# EAGLE design raspilot (EAGLE 7.2.0)
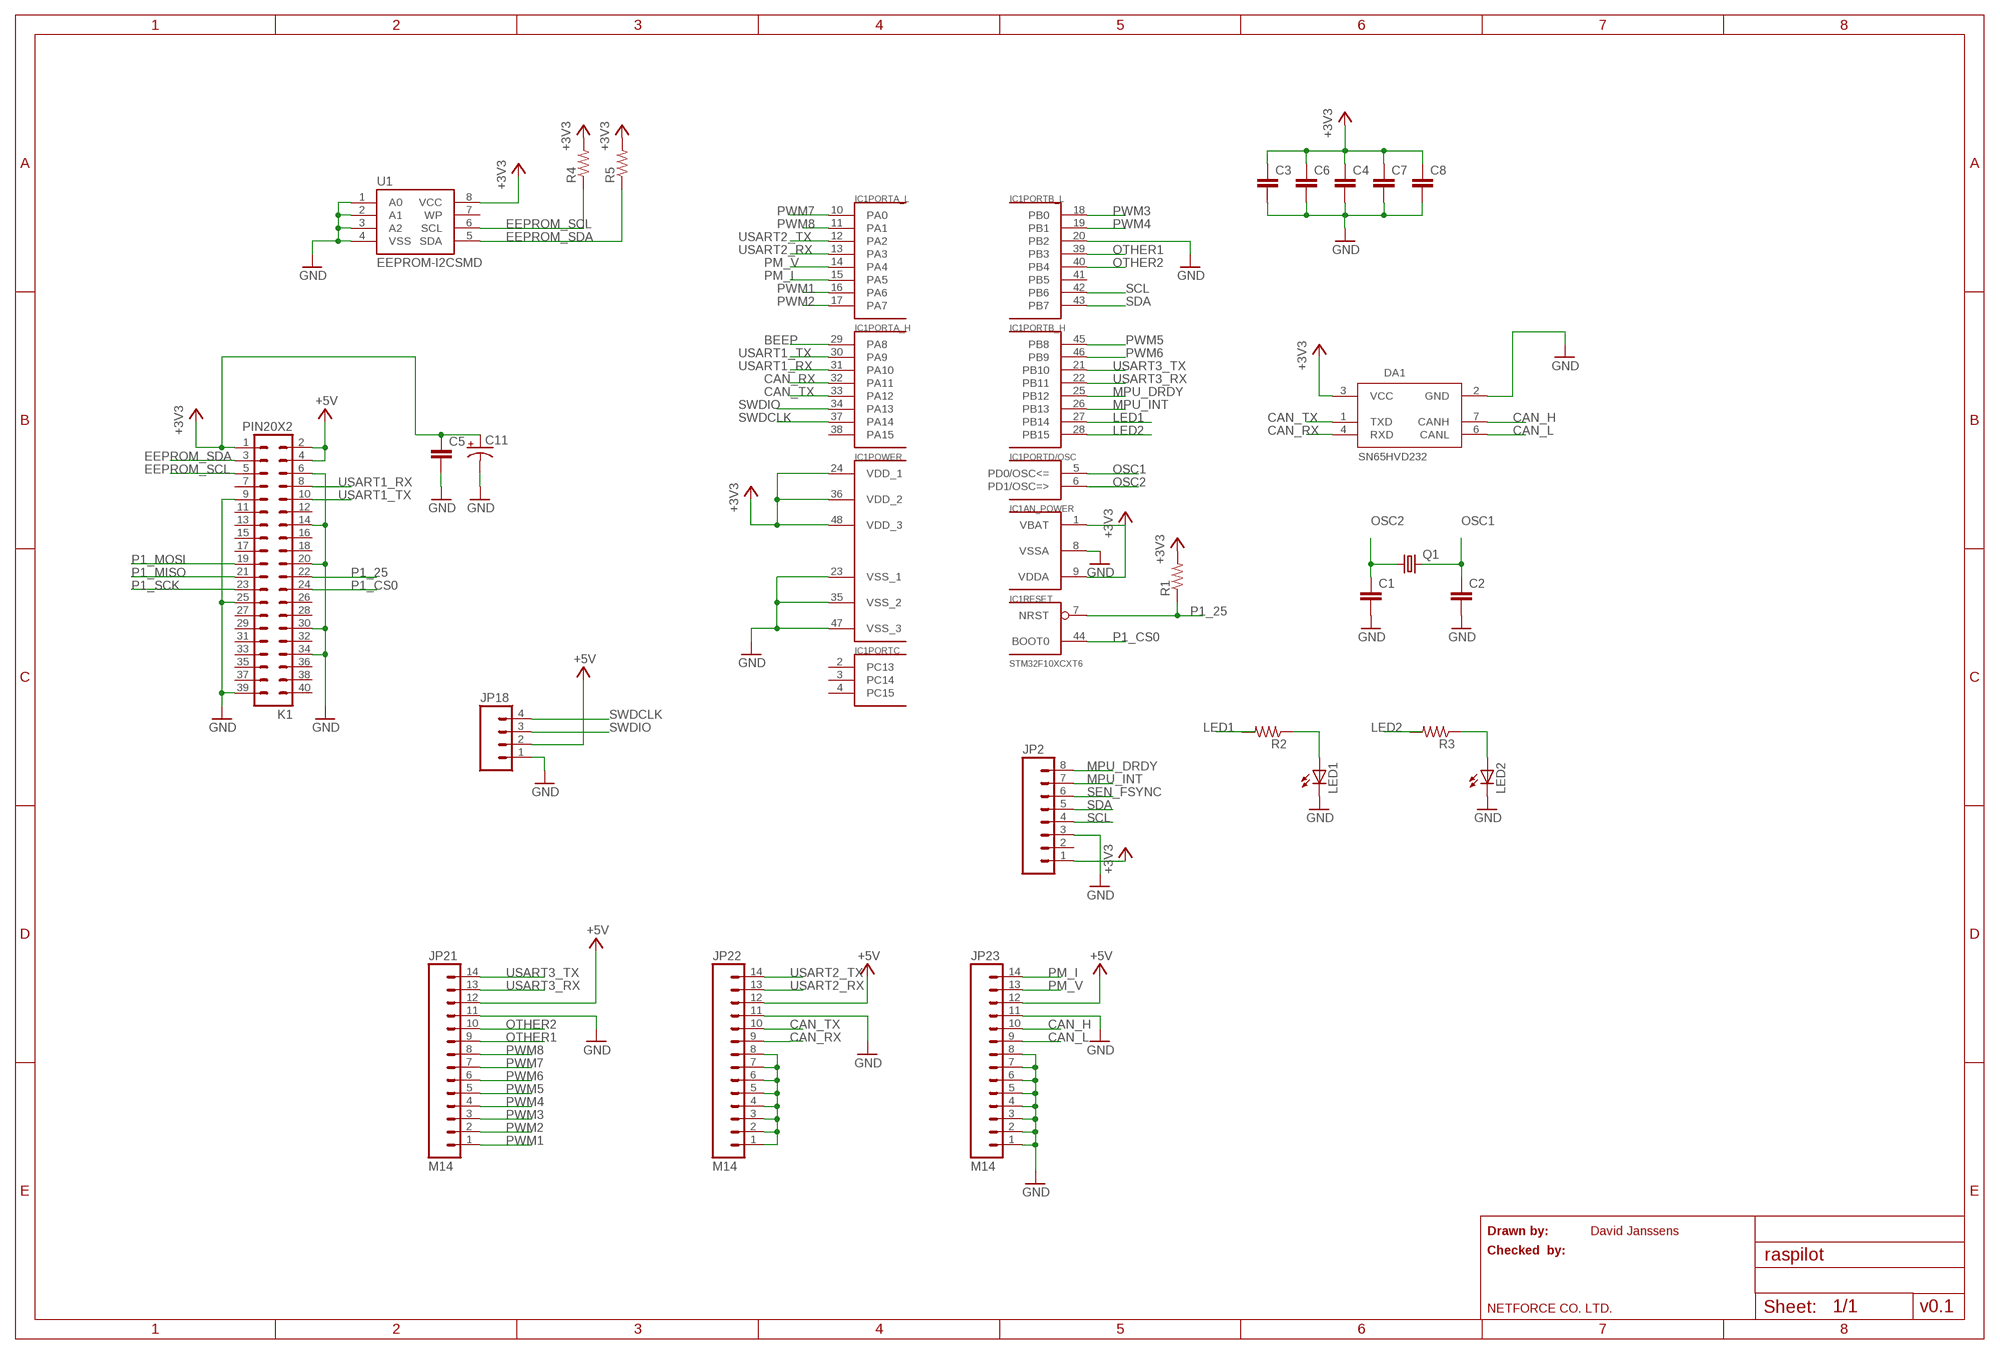
[diagram p0: schematic, sheet 1]

## Parts
C1  CAP0805  [0805]
C2  CAP0805  [0805]
C3  CAP0805  [0805]
C4  CAP0805  [0805]
C5  CAP0805  [0805]
C6  CAP0805  [0805]
C7  CAP0805  [0805]
C8  CAP0805  [0805]
C11  CPOL-USE2.5-6  [E2,5-6]
DA1  SN65HVD232  [SO08]
IC1  STM32F10XCXT6  [TQFP48]
JP2  M08  [1X08_ROUND]
JP18  M04PTH  [1X04]
JP21  M14  [1X14]
JP22  M14  [1X14]
JP23  M14  [1X14]
K1  PIN20X2  [PIN_20X2]
LED1  LED3MM  [LED3MM]
LED2  LED3MM  [LED3MM]
Q1  CRYSTALHC49S  [HC49/S]
R1  RESISTOR0805-RES  [0805]
R2  RESISTOR0805-RES  [0805]
R3  RESISTOR0805-RES  [0805]
R4  RESISTOR0805-RES  [0805]
R5  RESISTOR0805-RES  [0805]
U1  EEPROM-I2CSMD  [SO08]

## Nets
+3V3: C3.1 C4.1 C5.1 C6.1 C7.1 C8.1 C11.+ DA1.3(VCC) IC1.1(AN_POWER:VBAT) IC1.9(AN_POWER:VDDA) IC1.24(POWER:VDD_1) IC1.36(POWER:VDD_2) IC1.48(POWER:VDD_3) JP2.1 K1.1 R1.2 R4.2 R5.2 U1.8(VCC)
+5V: JP18.2 JP21.12 JP22.12 JP23.12 K1.2 K1.4
BEEP: IC1.29(PORTA_H:PA8)
CAN_H: DA1.7(CANH) JP23.10
CAN_L: DA1.6(CANL) JP23.9
CAN_RX: DA1.4(RXD) IC1.32(PORTA_H:PA11) JP22.9
CAN_TX: DA1.1(TXD) IC1.33(PORTA_H:PA12) JP22.10
EEPROM_SCL: K1.5 R4.1 U1.6(SCL)
EEPROM_SDA: K1.3 R5.1 U1.5(SDA)
GND: C1.2 C2.2 C3.2 C4.2 C5.2 C6.2 C7.2 C8.2 C11.- DA1.2(GND) IC1.8(AN_POWER:VSSA) IC1.20(PORTB_L:PB2) IC1.23(POWER:VSS_1) IC1.35(POWER:VSS_2) IC1.47(POWER:VSS_3) JP2.3 JP18.1 JP21.11 JP22.11 JP23.1 JP23.2 JP23.3 JP23.4 JP23.5 JP23.6 JP23.7 JP23.8 JP23.11 K1.6 K1.9 K1.14 K1.20 K1.25 K1.30 K1.34 K1.39 LED1.K(C) LED2.K(C) U1.1(A0) U1.2(A1) U1.3(A2) U1.4(VSS)
LED1: IC1.27(PORTB_H:PB14) R2.2
LED2: IC1.28(PORTB_H:PB15) R3.2
MPU_DRDY: IC1.25(PORTB_H:PB12) JP2.8
MPU_INT: IC1.26(PORTB_H:PB13) JP2.7
N$1: LED1.A R2.1
N$3: JP22.1 JP22.2 JP22.3 JP22.4 JP22.5 JP22.6 JP22.7 JP22.8
N$5: LED2.A R3.1
OSC1: C2.1 IC1.5(PORTD/OSC:PD0/OSC<=) Q1.2
OSC2: C1.1 IC1.6(PORTD/OSC:PD1/OSC=>) Q1.1
OTHER1: IC1.39(PORTB_L:PB3) JP21.9
OTHER2: IC1.40(PORTB_L:PB4) JP21.10
P1_25: IC1.7(RESET:NRST) K1.22 R1.1
P1_CS0: IC1.44(RESET:BOOT0) K1.24
P1_MISO: K1.21
P1_MOSI: K1.19
P1_SCK: K1.23
PM_I: IC1.15(PORTA_L:PA5) JP23.14
PM_V: IC1.14(PORTA_L:PA4) JP23.13
PWM1: IC1.16(PORTA_L:PA6) JP21.1
PWM2: IC1.17(PORTA_L:PA7) JP21.2
PWM3: IC1.18(PORTB_L:PB0) JP21.3
PWM4: IC1.19(PORTB_L:PB1) JP21.4
PWM5: IC1.45(PORTB_H:PB8) JP21.5
PWM6: IC1.46(PORTB_H:PB9) JP21.6
PWM7: IC1.10(PORTA_L:PA0) JP21.7
PWM8: IC1.11(PORTA_L:PA1) JP21.8
SCL: IC1.42(PORTB_L:PB6) JP2.4
SDA: IC1.43(PORTB_L:PB7) JP2.5
SEN_FSYNC: JP2.6
SWDCLK: IC1.37(PORTA_H:PA14) JP18.4
SWDIO: IC1.34(PORTA_H:PA13) JP18.3
USART1_RX: IC1.31(PORTA_H:PA10) K1.8
USART1_TX: IC1.30(PORTA_H:PA9) K1.10
USART2_RX: IC1.13(PORTA_L:PA3) JP22.13
USART2_TX: IC1.12(PORTA_L:PA2) JP22.14
USART3_RX: IC1.22(PORTB_H:PB11) JP21.13
USART3_TX: IC1.21(PORTB_H:PB10) JP21.14
Unconnected: IC1.2(PORTC:PC13) IC1.3(PORTC:PC14) IC1.4(PORTC:PC15) IC1.38(PORTA_H:PA15) IC1.41(PORTB_L:PB5) JP2.2 K1.7 K1.11 K1.12 K1.13 K1.15 K1.16 K1.17 K1.18 K1.26 K1.27 K1.28 K1.29 K1.31 K1.32 K1.33 K1.35 K1.36 K1.37 K1.38 K1.40 U1.7(WP)

## Notes on the sheet
- Drawn by: | David Janssens
- Checked  by:
- NETFORCE CO. LTD. | v0.1

## Library data of the parts
C1-C8 = SparkFun-Passives:CAP: Capacitor Standard 0603 ceramic capacitor, and 0.1" leaded capacitor.
C11 = adafruit:CPOL-US: POLARIZED CAPACITOR, American symbol
DA1 = transceiver:SN65HVD232: CAN TRANSCEIVER
IC1 = stm32:STM32F10XCXT6: ST STM32F101/103 48pin LQFP
JP2 = SparkFun-Connectors:M08: Header 8 Standard 8-pin 0.1" header. Use with straight break away headers (SKU : PRT-00116), right angle break away headers (PRT-00553), swiss pins (PRT-00743), machine pins (PRT-00117), and female headers (PRT-00115).
JP18 = SparkFun-Connectors:M04: Header 4 Standard 4-pin 0.1" header. Use with straight break away headers (SKU : PRT-00116), right angle break away headers (PRT-00553), swiss pins (PRT-00743), machine pins (PRT-00117), and female headers (PRT-00115). Molex polarized connector foot print use with SKU : PRT-08231 with associated crimp pins and housings. 1MM SMD Version SKU: PRT-10208
JP21-JP23 = SparkFun-Connectors:M14: Header 14 Standard 14-pin 0.1" header. Use with straight break away headers (SKU : PRT-00116), right angle break away headers (PRT-00553), swiss pins (PRT-00743), machine pins (PRT-00117), and female headers (PRT-00115).
K1 = FLYFISH:PIN20X2
LED1 LED2 = adafruit:LED: LED OSRAM: - CHIPLED LG R971, LG N971, LY N971, LG Q971, LY Q971, LO R971, LY R971 LH N974, LH R974 LS Q976, LO Q976, LY Q976 LO Q996 - Hyper CHIPLED LW Q18S LB Q993, LB Q99A, LB R99A - SideLED LS A670, LO A670, LY A670, LG A670, LP A670 LB A673, LV A673, LT A673, LW A673 LH A674 LY A675 LS A676, LA A676, LO A676, LY A676, LW A676 LS A679, LY A679, LG A679 - Hyper Micro SIDELED® LS Y876, LA Y876, LO Y876, LY Y876 LT Y87S - SmartLED LW L88C, LW L88S LB L89C, LB L89S, LG L890 LS L89K, LO L89K, LY L89K LS L896, LA L896, LO L896, LY L896 - TOPLED LS T670, LO T670, LY T670, LG T670, LP T670 LSG T670, LSP T670, LSY T670, LOP T670, LYG T670 LG T671, LOG T671, LSG T671 LB T673, LV T673, LT T673, LW T673 LH T674 LS T676, LA T676, LO T676, LY T676, LB T676, LH T676, LSB T676, LW T676 LB T67C, LV T67C, LT T67C, LS T67K, LO T67K, LY T67K, LW E67C LS E67B, LA E67B, LO E67B, LY E67B, LB E67C, LV E67C, LT E67C LW T67C LS T679, LY T679, LG T679 LS T770, LO T770, LY T770, LG T770, LP T770 LB T773, LV T773, LT T773, LW T773 LH T774 LS E675, LA E675, LY E675, LS T675 LS T776, LA T776, LO T776, LY T776, LB T776 LHGB T686 LT T68C, LB T68C - Hyper Mini TOPLED® LB M676 - Mini TOPLED Santana® LG M470 LS M47K, LO M47K, LY M47K Source: http://www.osram.convergy.de/
Q1 = adafruit:CRYSTAL: CRYSTAL; OC_FARNELL: 1667008; OC_NEWARK: unknown
R1-R5 = SparkFun-Passives:RESISTOR: Resistor Basic schematic elements and footprints for 0603, 1206, and PTH resistors.
U1 = SparkFun-DigitalIC:EEPROM-I2C: I2C EEPROM chips, 24LC256 (and others)

## Board
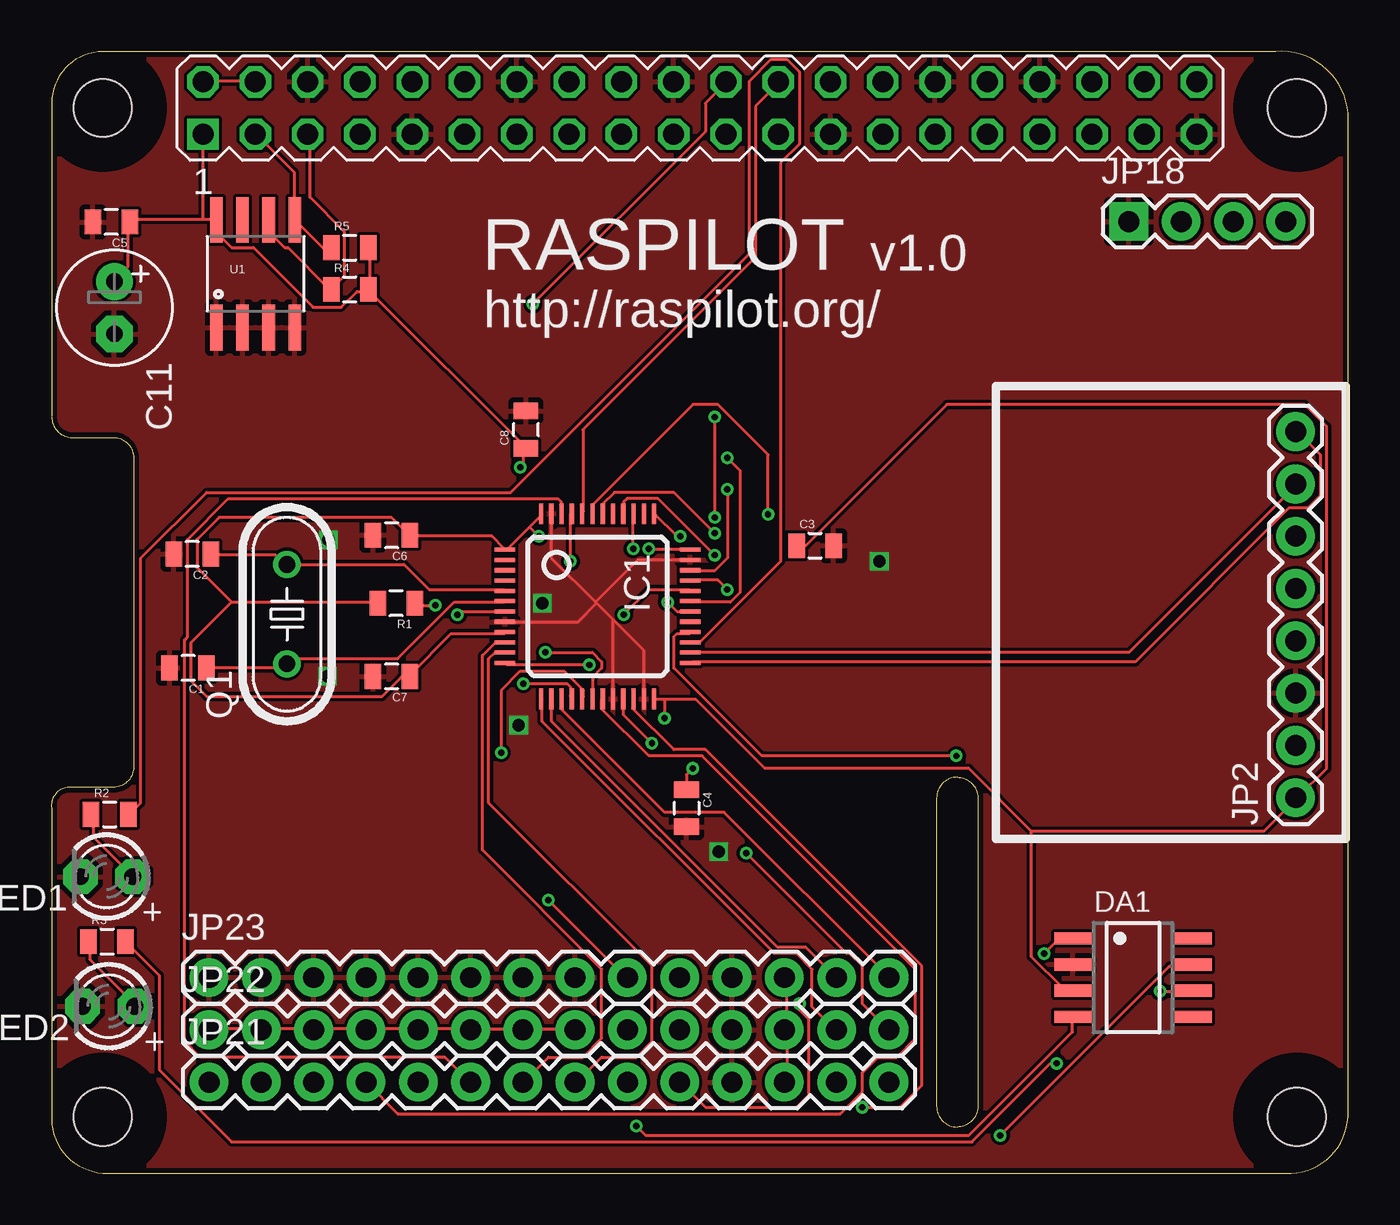
[diagram p1: board, top side]
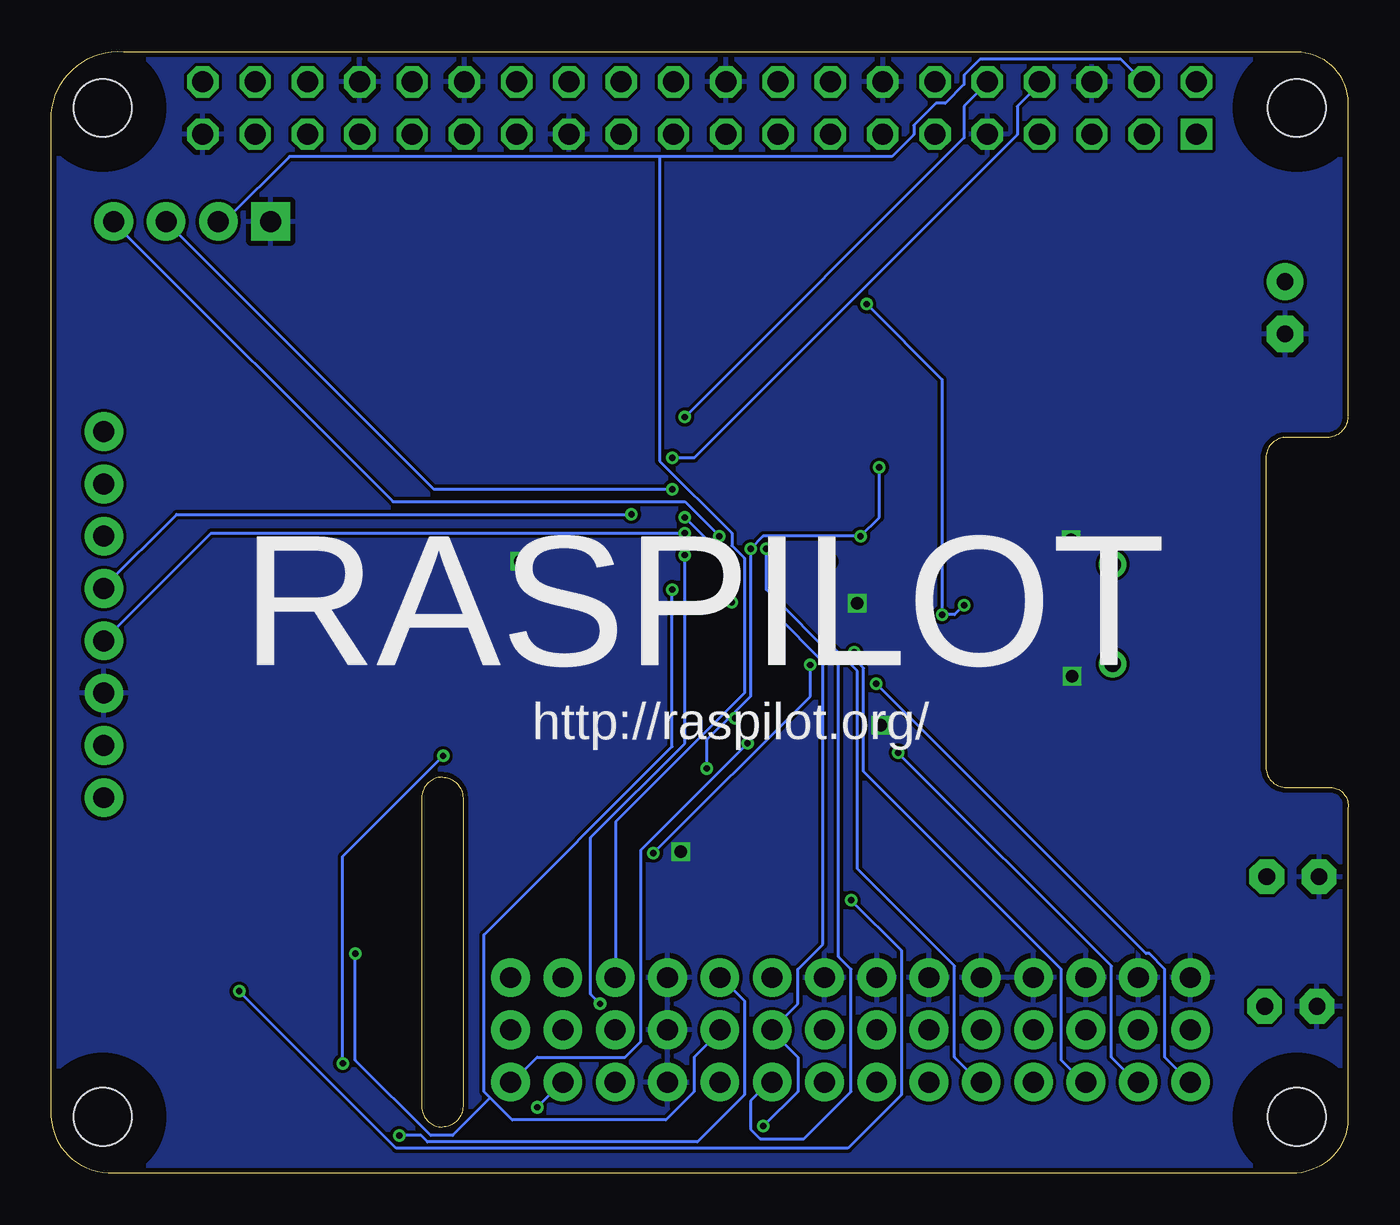
[diagram p2: board, bottom side, seen from below]

Size 62.98 x 54.49 mm. Coordinates in mm from the lower left corner, seen from the top.
Outline: 0.01,51.98 arc-90 2.5,54.48 59.47,54.48 arc-90 62.98,51.48 62.98,3 arc-90 60.23,0 2.5,0 arc-90 0.01,2.87 0.01,17.74 arc-90 0.75,18.74 2.99,18.74 arc90 3.99,19.74 3.99,34.74 arc90 2.99,35.74 1.01,35.74 arc-90 0.01,36.74
Outline: 0.01,52.03 0.01,36.78
Outline: 42.99,18.24 42.99,3.24 arc90 43.99,2.24 arc90 44.99,3.24 44.99,18.24 arc90 43.99,19.24 arc90 42.99,18.24
Copper layers (1*16): Top 0.035mm / dielectric 1.5mm / Bottom 0.035mm
Design rules "ITEADstudio_DRC": minimum track width 6mil, minimum drill 12mil, track to track 6mil, track to pad 6mil, pad to pad 6mil, via to via 6mil, smd to smd 0mil, copper to edge 10mil, drill to drill 10mil, minimum pad ring 10mil, minimum via ring 6mil, stop-mask expansion 2mil, vias tented up to drill 100mil, thermal gap 10mil
Holes 2.8 mm at 2.49,2.74 2.49,51.74 60.49,51.74 60.49,2.74
tRestrict: area 0.9,50.2 to 4,53.3; area 58.9,50.2 to 62,53.3; area 58.9,1.2 to 62,4.3; area 0.9,1.2 to 4,4.3
bRestrict: area 0.9,1.2 to 4,4.3; area 0.9,50.2 to 4,53.3; area 58.9,1.2 to 62,4.3; area 58.9,50.2 to 62,53.3
Milling: 6 lines

### Footprints (pad centres in the part's own frame; a part is rotated, then mirrored left to right if it is on the bottom)
0805 = smd 0.8 x 1.2: 1 -0.9,0; 2 0.9,0
E2,5-6 = drill 0.813 pad 1.778: + -1.27,0 | drill 0.813 pad 1.778 octagon: - 1.27,0
SO08 = smd 0.6 x 1.8: 1 -1.905,-2.917; 2 -0.635,-2.917; 3 0.635,-2.917; 4 1.905,-2.917; 5 1.905,2.917; 6 0.635,2.917; 7 -0.635,2.917; 8 -1.905,2.917
TQFP48 = smd 0.2 x 1: 1 -2.75,-4.5; 2 -2.25,-4.5; 3 -1.75,-4.5; 4 -1.25,-4.5; 5 -0.75,-4.5; 6 -0.25,-4.5; 7 0.25,-4.5; 8 0.75,-4.5; 9 1.25,-4.5; 10 1.75,-4.5; 11 2.25,-4.5; 12 2.75,-4.5; 25 2.75,4.5; 26 2.25,4.5; 27 1.75,4.5; 28 1.25,4.5; 29 0.75,4.5; 30 0.25,4.5; 31 -0.25,4.5; 32 -0.75,4.5; 33 -1.25,4.5; 34 -1.75,4.5; 35 -2.25,4.5; 36 -2.75,4.5 | smd 1 x 0.2: 13 4.5,-2.75; 14 4.5,-2.25; 15 4.5,-1.75; 16 4.5,-1.25; 17 4.5,-0.75; 18 4.5,-0.25; 19 4.5,0.25; 20 4.5,0.75; 21 4.5,1.25; 22 4.5,1.75; 23 4.5,2.25; 24 4.5,2.75; 37 -4.5,2.75; 38 -4.5,2.25; 39 -4.5,1.75; 40 -4.5,1.25; 41 -4.5,0.75; 42 -4.5,0.25; 43 -4.5,-0.25; 44 -4.5,-0.75; 45 -4.5,-1.25; 46 -4.5,-1.75; 47 -4.5,-2.25; 48 -4.5,-2.75
1X08_ROUND = drill 1.016 pad 1.88: 1 0,0; 2 2.54,0; 3 5.08,0; 4 7.62,0; 5 10.16,0; 6 12.7,0; 7 15.24,0; 8 17.78,0
1X04 = drill 1.016 pad 1.88 square: 1 0,0 | drill 1.016 pad 1.88: 2 2.54,0; 3 5.08,0; 4 7.62,0
1X14 = drill 1.016 pad 1.88: 1 0,0; 2 2.54,0; 3 5.08,0; 4 7.62,0; 5 10.16,0; 6 12.7,0; 7 15.24,0; 8 17.78,0; 9 20.32,0; 10 22.86,0; 11 25.4,0; 12 27.94,0; 13 30.48,0; 14 33.02,0
PIN_20X2 = drill 1.016 square: 1 -24.13,-1.27 | drill 1.016 octagon: 2 -24.13,1.27; 3 -21.59,-1.27; 4 -21.59,1.27; 5 -19.05,-1.27; 6 -19.05,1.27; 7 -16.51,-1.27; 8 -16.51,1.27; 9 -13.97,-1.27; 10 -13.97,1.27; 11 -11.43,-1.27; 12 -11.43,1.27; 13 -8.89,-1.27; 14 -8.89,1.27; 15 -6.35,-1.27; 16 -6.35,1.27; 17 -3.81,-1.27; 18 -3.81,1.27; 19 -1.27,-1.27; 20 -1.27,1.27; 21 1.27,-1.27; 22 1.27,1.27; 23 3.81,-1.27; 24 3.81,1.27; 25 6.35,-1.27; 26 6.35,1.27; 27 8.89,-1.27; 28 8.89,1.27; 29 11.43,-1.27; 30 11.43,1.27; 31 13.97,-1.27; 32 13.97,1.27; 33 16.51,-1.27; 34 16.51,1.27; 35 19.05,-1.27; 36 19.05,1.27; 37 21.59,-1.27; 38 21.59,1.27; 39 24.13,-1.27; 40 24.13,1.27
LED3MM = drill 0.813 pad 1.676 octagon: A -1.27,0; K 1.27,0
HC49/S = drill 0.813: 1 -2.413,0; 2 2.413,0
SO08' = smd 0.61 x 2.21: 1 -1.905,-2.616; 2 -0.635,-2.616; 3 0.635,-2.616; 4 1.905,-2.616; 5 1.905,2.616; 6 0.635,2.616; 7 -0.635,2.616; 8 -1.905,2.616

### Placement (x,y rotation side)
C1  6.64,24.54 180 top
C2  6.84,30.07 180 top
C3  37.09,30.48 0 top
C4  30.84,17.73 270 top
C5  2.9,46.2 180 top
C6  16.52,30.99 180 top
C7  16.52,24.13 180 top
C8  23.05,36.12 90 top
C11  3.06,42.04 270 top
DA1  52.54,9.5 270 top
IC1  26.53,27.53 270 top
JP2  60.43,18.24 90 top
JP18  52.33,46.23 0 top
JP21  7.65,4.42 0 top
JP22  7.65,6.96 0 top
JP23  7.65,9.5 0 top
K1  31.49,51.74 0 top
LED1  2.68,14.4 180 top
LED2  2.78,8.1 180 top
Q1  11.44,27.15 90 top
R1  16.75,27.69 180 top
R2  2.83,17.42 0 top
R3  2.7,11.25 0 top
R4  14.49,42.93 0 top
R5  14.49,44.96 0 top
U1  EEPROM-I2CSMD  [SO08']  9.91,43.69 0 top

### Tracks (layer width: path | path; a pad name or v marks a point on that pad's centre or on a via)
+3V3  (via drill 0.3)
  Top 0.152: R4.2 15.45,42.98 15.45,44.96 R5.2 | R4.2 15.45,42.82 22.92,35.36 C8.1 22.92,35.2 22.92,34.44 v22.77,34.29 | C11.+ 3.11,43.43 3.72,44.04 3.72,46.18 C5.1 3.87,46.33 7.37,46.33 | 7.37,46.33 7.98,46.33 U1.8 8.14,46.18 8.14,45.57 8.75,44.96 9.81,44.96 12.71,42.06 14.08,42.06 14.84,42.82 15.3,42.82 R4.2 | 7.37,46.33 7.37,50.44 K1.1 | IC1.9 22,26.21 19.41,26.21 17.43,24.23 C7.1 17.28,24.08 16.98,24.08 16.06,23.16 7.53,23.16 6.76,23.93 6.76,25.76 8.75,27.74 | 8.75,27.74 15.76,27.74 R1.2 | 8.75,27.74 7.07,29.41 7.07,30.79 8.14,31.85 16.52,31.85 17.28,31.09 C6.1 17.43,30.94 21.4,30.94 22,30.33 IC1.1 22.16,30.33 23.22,31.39 | 23.22,31.39 23.83,32 IC1.48 | v29.02,30.33 31,30.33 IC1.36 | 23.22,31.39 v23.68,30.94 | v31.15,19.66 30.84,19.36 30.84,18.75 C4.1 | 29.78,23.01 31.3,23.01 34.65,19.66 44.56,19.66 47.61,16.61 | 29.78,23.01 29.32,23.01 IC1.24 | 47.61,16.61 47.61,10.52 49.13,8.99 49.59,8.99 DA1.3 | C3.1 36.33,30.48 36.64,30.48 43.49,37.34 60.87,37.34 61.93,36.27 61.93,19.66 60.56,18.29 JP2.1 60.41,18.14 58.89,16.61 47.61,16.61 | 29.78,23.01 v29.78,22.1
  Bottom 0.152: v31.15,19.66 31.15,21.03 29.93,22.25 | 29.93,22.25 29.02,23.16 v29.02,30.33 28.41,30.94 v23.68,30.94 22.77,31.85 v22.77,34.29 | v29.78,22.1 29.93,22.25
+5V
  Top 0.152: JP21.12 35.72,4.42 35.72,6.86 JP22.12 35.72,7.01 35.72,9.45 JP23.12 | K1.2 7.37,53.03 9.81,53.03 K1.4
  Bottom 0.152: 33.43,49.38 22.16,49.38 21.09,50.44 21.09,50.9 20.02,51.97 19.57,51.97 18.65,52.88 18.65,53.34 17.89,54.1 11.03,54.1 9.97,53.03 K1.4 | 33.43,49.38 51.42,49.38 54.47,46.33 54.77,46.33 JP18.2 | 33.43,49.38 33.43,34.59 29.93,31.09 29.93,30.48 29.32,29.87 29.32,23.32 35.57,17.07 35.57,9.6 JP23.12
CAN_H  (via drill 0.3)
  Top 0.152: v46.08,1.83 54.31,10.06 55.38,10.06 DA1.7
  Bottom 0.152: v46.08,1.83 45.02,1.83 44.71,1.52 31.61,1.52 29.32,3.81 29.32,8.38 30.39,9.45 JP23.10
CAN_L  (via drill 0.3)
  Top 0.152: v53.86,8.84 55.38,8.84 DA1.6 | v24.14,13.26 27.95,9.45 JP23.9
  Bottom 0.152: v53.86,8.84 46.24,1.22 24.29,1.22 21.7,3.81 21.7,10.82 v24.14,13.26
CAN_RX  (via drill 0.3)
  Top 0.152: v27.8,27.13 29.02,28.35 31,28.35 IC1.32 | v28.41,2.29 28.86,1.83 44.56,1.83 49.59,6.86 49.59,7.47 DA1.4
  Bottom 0.152: v27.8,27.13 25.51,24.84 25.51,11.12 26.73,9.91 26.73,8.23 27.95,7.01 JP22.9 27.95,6.86 26.73,5.64 26.73,3.96 v28.41,2.29
CAN_TX  (via drill 0.3)
  Top 0.152: v32.83,28.35 32.37,28.8 31.15,28.8 IC1.33 | v48.22,10.67 48.83,11.28 49.59,11.28 DA1.1
  Bottom 0.152: v32.83,28.35 32.83,20.73 41.97,11.58 41.97,3.96 41.66,3.66 | 41.66,3.66 40.6,2.59 33.13,2.59 31.76,3.96 31.76,5.64 30.54,6.86 JP22.10 | v48.22,10.67 48.22,5.49 44.56,1.83 43.49,1.83 41.66,3.66
EEPROM_SCL
  Top 0.152: U1.6 10.57,46.18 10.57,45.72 11.34,44.96 11.49,44.96 13.47,42.98 R4.1 13.62,42.98 14.23,43.59 14.23,45.72 12.56,47.4 12.56,50.44 K1.5
EEPROM_SDA
  Top 0.152: R5.1 13.47,44.96 13.17,44.96 11.95,46.18 U1.5 11.79,46.33 11.79,48.62 9.97,50.44 K1.3
GND  (via drill 0.6)
  Top 0.152: IC1.47 24.28,29.88 26.42,27.74 | 26.42,27.74 26.48,27.69 | IC1.8 25.57,26.78 26.48,27.69 | IC1.20 27.28,26.88 | 27.28,26.88 26.48,27.69 | IC1.23 28.78,25.38 27.28,26.88 | IC1.35 28.47,29.78 26.42,27.74
  other vias: 23.83,27.69 13.39,24.13 13.45,30.76 40.22,29.72 22.69,21.77 32.42,15.62
  pour Bottom: 0.01,2.36 arc90 3.26,0 59.98,0 arc90 62.98,3.25 62.98,51.22 arc90 59.98,54.48 3.01,54.48 arc90 0.01,51.22 0.01,36.74 arc90 1.01,35.74 2.99,35.74 arc-90 3.99,34.74 3.99,19.74 arc-90 2.99,18.74 1.01,18.74 arc90 0.01,17.74
  pour Top: 0.01,2.49 arc90 3.26,0 59.98,0 arc90 62.98,3.25 62.98,51.22 arc90 59.98,54.48 3.01,54.48 arc90 0.01,51.73 0.01,36.74 arc90 1.01,35.74 2.99,35.74 arc-90 3.99,34.74 3.99,19.74 arc-90 2.99,18.74 1.01,18.74 arc90 0.01,17.74
LED1
  Top 0.152: IC1.27 31.15,25.76 31.45,25.76 35.42,29.72 35.42,49.07 36.33,49.99 36.33,53.49 35.72,54.1 34.96,54.1 33.89,53.03 33.89,44.65 22.31,33.07 7.53,33.07 4.33,29.87 4.33,17.98 3.87,17.53 R2.2
LED2  (via drill 0.3)
  Top 0.152: v43.95,20.27 34.5,20.27 30.23,24.54 30.23,26.06 30.39,26.21 31,26.21 IC1.28 | v48.83,5.33 48.52,5.33 44.71,1.52 8.75,1.52 5.24,5.03 5.24,9.6 3.72,11.12 R3.2
  Bottom 0.152: v43.95,20.27 48.83,15.39 v48.83,5.33
MPU_DRDY
  Top 0.152: IC1.25 31.15,24.84 52.64,24.84 60.1,32.31 61.02,32.31 61.63,32.92 61.63,34.9 60.56,35.97 JP2.8
MPU_INT
  Top 0.152: IC1.26 31.15,25.3 52.33,25.3 60.41,33.38 JP2.7
N$1
  Top 0.152: R2.1 2.04,17.37 2.04,16.31 3.87,14.48 LED1.A
N$3
  Top 0.152: JP22.1 7.68,7.01 10.12,7.01 JP22.2 10.27,7.01 12.71,7.01 JP22.3 12.86,7.01 15.15,7.01 JP22.4 15.3,7.01 17.74,7.01 JP22.5 17.89,7.01 20.33,7.01 JP22.6 20.48,7.01 22.77,7.01 JP22.7 22.92,7.01 25.36,7.01 JP22.8
N$5
  Top 0.152: R3.1 1.89,11.12 1.89,10.36 4.02,8.23 LED2.A
OSC1
  Top 0.152: IC1.5 22,28.35 18.35,28.35 17.13,29.57 11.49,29.57 Q1.2 11.34,29.57 10.88,30.02 7.83,30.02 C2.1
OSC2
  Top 0.152: IC1.6 22,27.74 19.57,27.74 16.82,24.99 11.64,24.99 11.49,24.84 Q1.1 11.34,24.69 11.18,24.54 7.68,24.54 C1.1
OTHER1  (via drill 0.3)
  Top 0.152: v28.25,30.33 28.25,32 IC1.39
  Bottom 0.152: v28.25,30.33 28.25,28.35 24.75,24.84 24.75,10.52 24.14,9.91 24.14,3.96 26.42,1.68 28.56,1.68 29.02,2.13 29.02,3.51 28.1,4.42 JP21.9
OTHER2  (via drill 0.3)
  Top 0.152: v32.22,30.02 29.47,32.77 27.95,32.77 27.8,32.61 27.8,32.16 IC1.40 | v36.33,8.23 36.33,7.92 36.79,7.47 36.79,3.81 36.18,3.2 31.76,3.2 30.54,4.42 JP21.10
  Bottom 0.152: v32.22,30.02 32.22,20.88 36.79,16.31 36.79,8.69 v36.33,8.23
P1_25  (via drill 0.3)
  Top 0.152: v19.72,27.13 19.87,27.28 22,27.28 IC1.7 | v18.65,27.58 17.74,27.58 R1.1 | v23.38,42.21 31.76,50.6 31.76,51.97 32.67,52.88 K1.22
  Bottom 0.152: v18.65,27.58 19.11,27.13 v19.72,27.13 19.72,38.56 v23.38,42.21
P1_CS0
  Top 0.152: IC1.44 25.81,32.16 25.81,36.12 34.2,44.5 34.2,51.82 35.26,52.88 K1.24
PM_I
  Top 0.152: IC1.15 24.75,23.01 24.75,22.55 29.78,17.53 32.67,17.53 40.6,9.6 JP23.14
PM_V
  Top 0.152: IC1.14 24.29,23.01 24.29,21.95 35.26,10.97 36.64,10.97 38.01,9.6 JP23.13
PWM1  (via drill 0.3)
  Top 0.152: v22.92,23.77 25.05,23.77 25.21,23.62 25.21,23.16 IC1.16
  Bottom 0.152: v22.92,23.77 9.81,10.67 9.66,10.67 8.9,9.91 8.9,5.64 7.68,4.42 JP21.1
PWM2  (via drill 0.3)
  Top 0.152: v21.85,20.42 21.85,23.47 22.77,24.38 24.9,24.38 25.81,23.47 25.81,23.16 IC1.17
  Bottom 0.152: v21.85,20.42 11.49,10.06 11.49,5.64 10.27,4.42 JP21.2
PWM3  (via drill 0.3)
  Top 0.152: v23.99,25.3 26.27,25.3 26.73,24.84 26.73,24.54 26.27,24.08 26.27,23.16 IC1.18
  Bottom 0.152: v23.99,25.3 23.99,24.99 23.53,24.54 23.53,19.51 13.93,9.91 13.93,5.49 12.86,4.42 JP21.3
PWM4
  Top 0.152: IC1.19 26.73,23.01 26.73,22.55 29.02,20.27 31.61,20.27 41.97,9.91 41.97,6.55 41.05,5.64 40.14,5.64 39.38,4.88 39.38,3.96 38.31,2.9 16.82,2.9 15.3,4.42 JP21.4
PWM5  (via drill 0.3)
  Top 0.152: v25.21,29.72 25.21,32 IC1.45
  Bottom 0.152: v25.21,29.72 25.21,25.76 23.83,24.38 23.83,14.78 19.11,10.06 19.11,5.64 17.89,4.42 JP21.5
PWM6
  Top 0.152: IC1.46 24.75,32.16 24.75,32.61 24.6,32.77 8.59,32.77 6.61,30.79 6.61,26.06 6.46,25.91 6.46,6.4 7.22,5.64 19.11,5.64 20.33,4.42 JP21.6
PWM7
  Top 0.152: IC1.10 22,25.76 21.55,25.76 20.94,25.15 20.94,15.7 26.73,9.91 26.73,6.55 25.81,5.64 24.14,5.64 22.92,4.42 JP21.7
PWM8
  Top 0.152: IC1.11 22,25.3 21.55,25.3 21.24,24.99 21.24,17.98 29.17,10.06 29.17,6.4 28.41,5.64 26.73,5.64 25.51,4.42 JP21.8
SCL  (via drill 0.3)
  Top 0.152: v32.22,31.09 30.23,33.07 27.34,33.07 26.73,32.46 26.73,32.16 IC1.42
  Bottom 0.152: v32.22,31.09 55.23,31.09 60.41,25.91 JP2.4
SDA  (via drill 0.3)
  Top 0.152: v34.81,32 34.81,34.9 32.37,37.34 31.15,37.34 26.27,32.46 26.27,32.16 IC1.43
  Bottom 0.152: v34.81,32 56.9,32 60.41,28.5 JP2.5
SWDCLK  (via drill 0.3)
  Top 0.152: v30.54,30.94 30.39,30.94 29.32,32 IC1.37
  Bottom 0.152: v30.54,30.94 32.22,32.61 46.39,32.61 59.95,46.18 JP18.4
SWDIO  (via drill 0.3)
  Top 0.152: v32.83,33.22 32.83,29.87 32.22,29.26 31.15,29.26 IC1.34
  Bottom 0.152: v32.83,33.22 44.41,33.22 57.36,46.18 JP18.3
USART1_RX  (via drill 0.3)
  Top 0.152: v32.83,34.75 33.43,34.14 33.43,28.19 32.98,27.74 31.15,27.74 IC1.31
  Bottom 0.152: v32.83,34.75 31.76,34.75 16.06,50.44 16.06,51.82 14.99,52.88 K1.8
USART1_TX  (via drill 0.3)
  Top 0.152: v29.93,27.74 30.39,27.28 31,27.28 IC1.30 | v32.22,36.73 v32.22,31.85
  Bottom 0.152: v29.93,27.74 29.93,29.57 v32.22,31.85 | v32.22,36.73 18.65,50.29 18.65,51.82 17.59,52.88 K1.10
USART2_RX
  Top 0.152: IC1.13 23.83,23.01 23.83,21.95 35.11,10.67 36.18,10.67 36.94,9.91 36.94,8.08 38.01,7.01 JP22.13
USART2_TX  (via drill 0.3)
  Top 0.152: v26.12,24.69 22.16,24.69 IC1.12 | v33.74,15.54 38.62,10.67 38.77,10.67 39.38,10.06 39.38,8.23 40.6,7.01 JP22.14
  Bottom 0.152: v26.12,24.69 26.12,23.16 v33.74,15.54
USART3_RX  (via drill 0.3)
  Top 0.152: v39.38,3.2 41.21,3.2 42.27,4.27 42.27,10.06 31.76,20.57 30.23,20.57 28.25,22.55 28.25,23.01 IC1.22
  Bottom 0.152: v39.38,3.2 38.16,4.42 JP21.13
USART3_TX  (via drill 0.3)
  Top 0.152: v29.17,20.88 27.8,22.25 27.8,23.01 IC1.21
  Bottom 0.152: v29.17,20.88 34.35,15.7 34.35,6.4 35.11,5.64 39.38,5.64 40.6,4.42 JP21.14

### Text on the board
tPlace: RASPILOT | v1.0 | http://raspilot.org/
bPlace: RASPILOT | RASPILOT | http://raspilot.org/